# Altium schematic sheet GeneratedSystem-02.SchDoc
size 168 x 103 mm
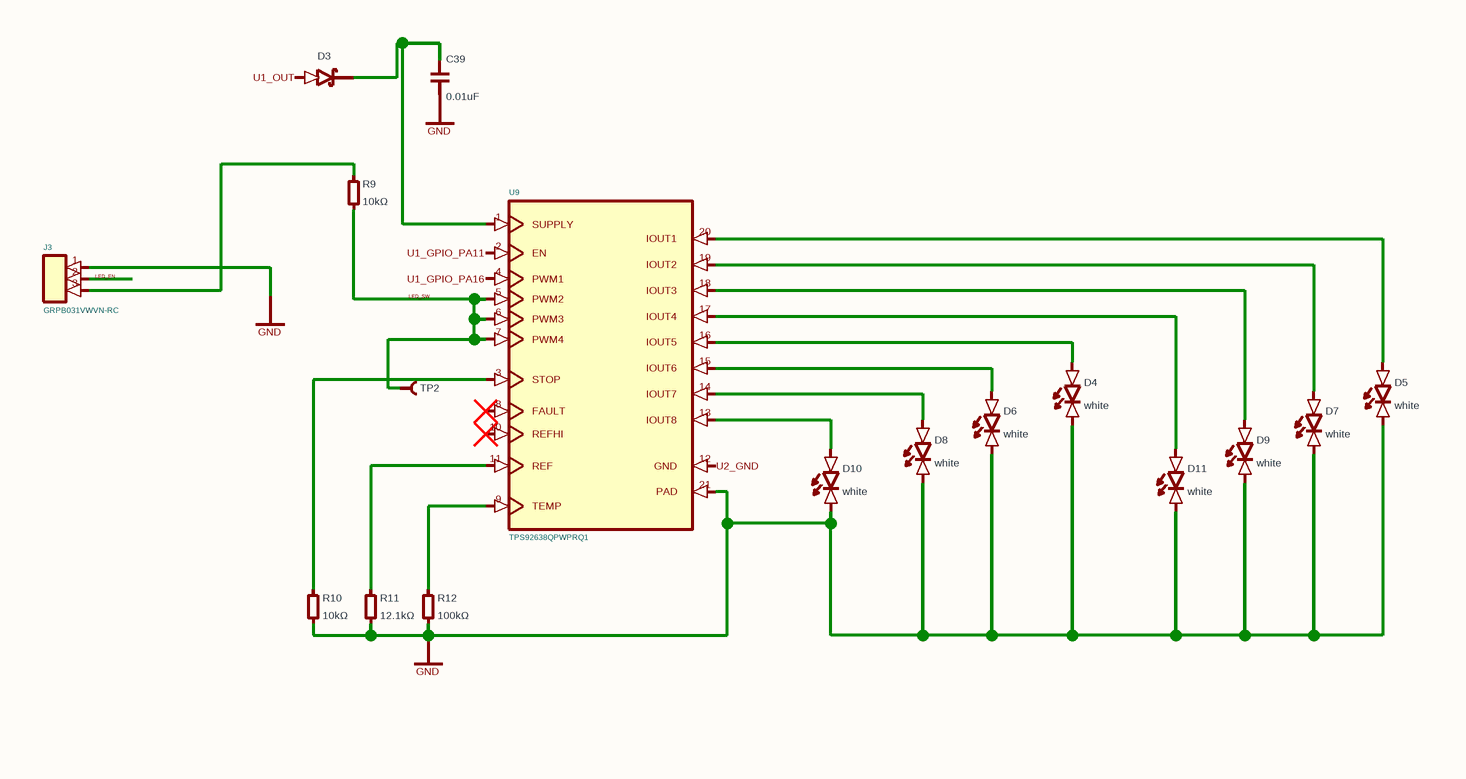
[diagram p0: GeneratedSystem-02.SchDoc]

## Parts
C39  0.01uF
D3  (no value)
D4  white
D5  white
D6  white
D7  white
D8  white
D9  white
D10  white
D11  white
J3  (no value)
R9  10kΩ
R10  10kΩ
R11  12.1kΩ
R12  100kΩ
TP2  (no value)
U9  (no value)

## Nets
GND: C39.2(cathode) D4.2(cathode) D5.2(cathode) D6.2(cathode) D7.2(cathode) D8.2(cathode) D9.2(cathode) D10.2(cathode) D11.2(cathode) J3.1(pin1) R10.2(cathode) R11.2(cathode) R12.2(cathode) U9.21(PAD)
U1_GPIO_PA11: U9.2(EN)
U1_GPIO_PA16: U9.4(PWM1)
U1_OUT: D3.1(pos)
U2_GND: U9.12(GND)
NetC39_1: C39.1(anode) D3.2(neg) U9.1(SUPPLY)
NetD4_1: D4.1(anode) U9.16(IOUT5)
NetD5_1: D5.1(anode) U9.20(IOUT1)
NetD6_1: D6.1(anode) U9.15(IOUT6)
NetD7_1: D7.1(anode) U9.19(IOUT2)
NetD8_1: D8.1(anode) U9.14(IOUT7)
NetD9_1: D9.1(anode) U9.18(IOUT3)
NetD10_1: D10.1(anode) U9.13(IOUT8)
NetD11_1: D11.1(anode) U9.17(IOUT4)
NetJ3_3: J3.3(pin3) R9.1(anode)
NetR9_2: R9.2(cathode) TP2.1(pin1) U9.5(PWM2) U9.6(PWM3) U9.7(PWM4)
NetR10_1: R10.1(anode) U9.3(STOP)
NetR11_1: R11.1(anode) U9.11(REF)
NetR12_1: R12.1(anode) U9.9(TEMP)

Not connected (* = marked no-connect by the designer): J3 2(pin2); U9 8(FAULT)* 10(REFHI)*

## Notes on the sheet
- (near J3) LED_EN
- LED_SW
- (in symbol J3) GRPB031VWVN-RC
- (in symbol U9) TPS92638QPWPRQ1

## Library data of the parts
C39 = capacitor_down
D3 = schottky_diode_right
D4-D11 = led_down
J3 = J3
R9-R12 = boxresistor_down
TP2 = testpoint_right
U9 = U9